# EAGLE schematic review (EAGLE 7.7.0)
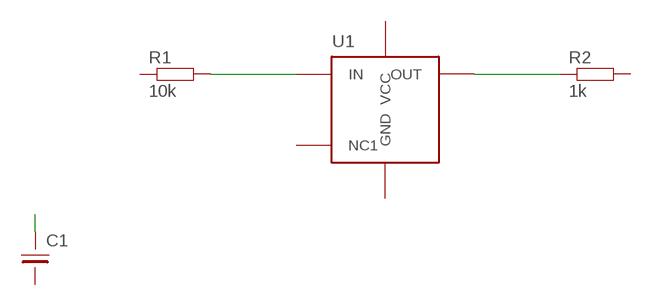
[diagram p0: schematic, sheet 1]

## Parts
C1  100n  CAP  (no package)
R1  10k  RES  (no package)
R2  1k  RES  (no package)
U1  AMP  (no package)

## Nets
C1_TOP: C1.1
IN: R1.2 U1.IN
OUT: R2.1 U1.OUT
Unconnected: C1.2 R1.1 R2.2 U1.GND U1.NC1 U1.VCC

## Library data of the parts
C1 = simple:CAP
R1 R2 = simple:RES
U1 = simple:AMP